# Altium schematic sheet 05_Peripheral.SchDoc
size A4
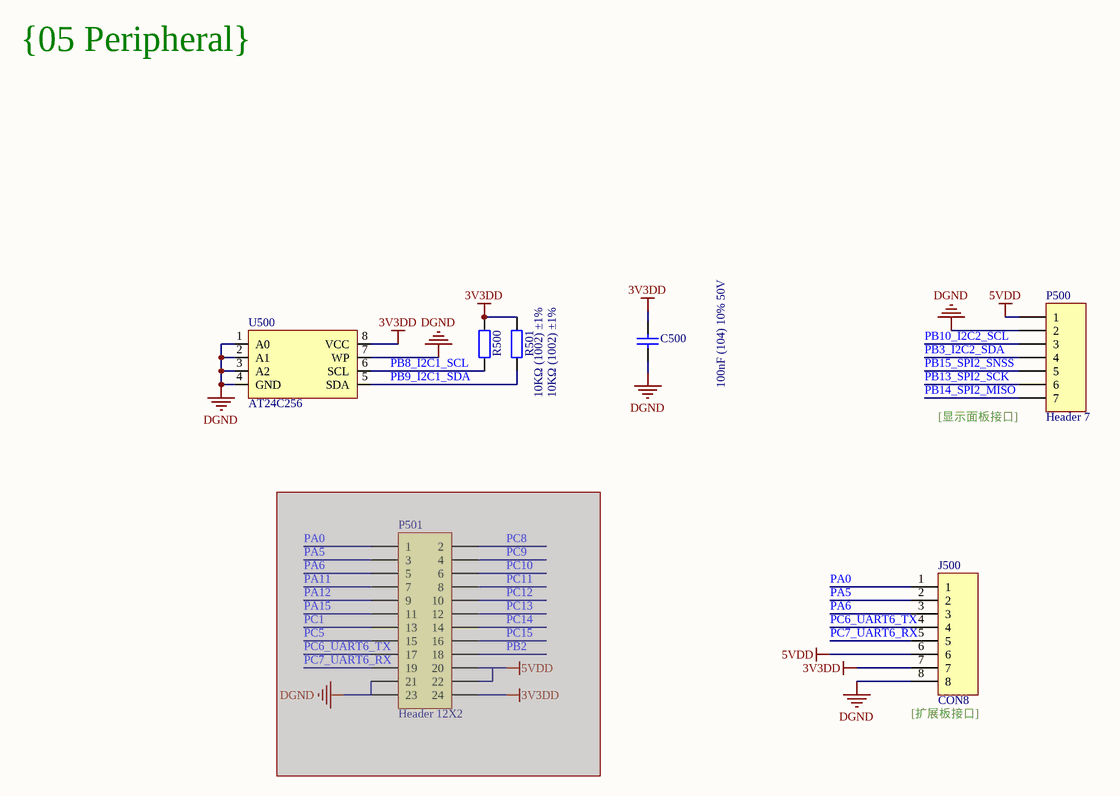
[diagram p0: 05_Peripheral.SchDoc]

## Parts
C500  100nF (104) 10% 50V  [LC-0603_C]
J500  CON8  [2.54_8P_PHI]
P500  Header 7  [XH2.54-7P]
P501  Header 12X2  [HDR2X12]  (masked out: inside a compile mask, not in the netlist)
R500  10KΩ (1002) ±1%  [LC-0603_R]
R501  10KΩ (1002) ±1%  [LC-0603_R]
U500  AT24C256  [SOIC8]

## Nets
3V3DD: C500.2 J500.7 R500.2 R501.2 U500.8(VCC)
5VDD: J500.6 P500.1
DGND: C500.1 J500.8 P500.2 U500.1(A0) U500.2(A1) U500.3(A2) U500.4(GND) U500.7(WP)
PA0: J500.1
PA5: J500.2
PA6: J500.3
PB3_I2C2_SDA: P500.4
PB8_I2C1_SCL: R500.1 U500.6(SCL)
PB9_I2C1_SDA: R501.1 U500.5(SDA)
PB10_I2C2_SCL: P500.3
PB13_SPI2_SCK: P500.6
PB14_SPI2_MISO: P500.7
PB15_SPI2_SNSS: P500.5
PC6_UART6_TX: J500.4
PC7_UART6_RX: J500.5

## Notes on the sheet
- {05 Peripheral}
- [显示面板接口]
- (near J500) [扩展板接口]

## Library data of the parts
C500 = 0603 100nF (104) 10% 50V: 贴片电容; ComponentLink1Description: 供应商链接; ComponentLink1URL: http://www.szlcsc.com/product/details_15331.html; Package: 0603; Supplier: LC; SuppliersPartNumber: C14663
P500 = Header 7: Header, 7-Pin; LatestRevisionDate: 17-Jul-2002; LatestRevisionNote: Re-released for DXP Platform.; Publisher: Altium Limited
P501 = Header 12X2: Header, 12-Pin, Dual row; LatestRevisionDate: 17-Jul-2002; LatestRevisionNote: Re-released for DXP Platform.; Publisher: Altium Limited
R500 R501 = 0603 10KΩ (1002) 1%: 贴片电阻; ComponentLink1Description: 供应商链接; ComponentLink1URL: http://www.szlcsc.com/product/details_26547.html; Package: 0603; Supplier: LC; SuppliersPartNumber: C25804